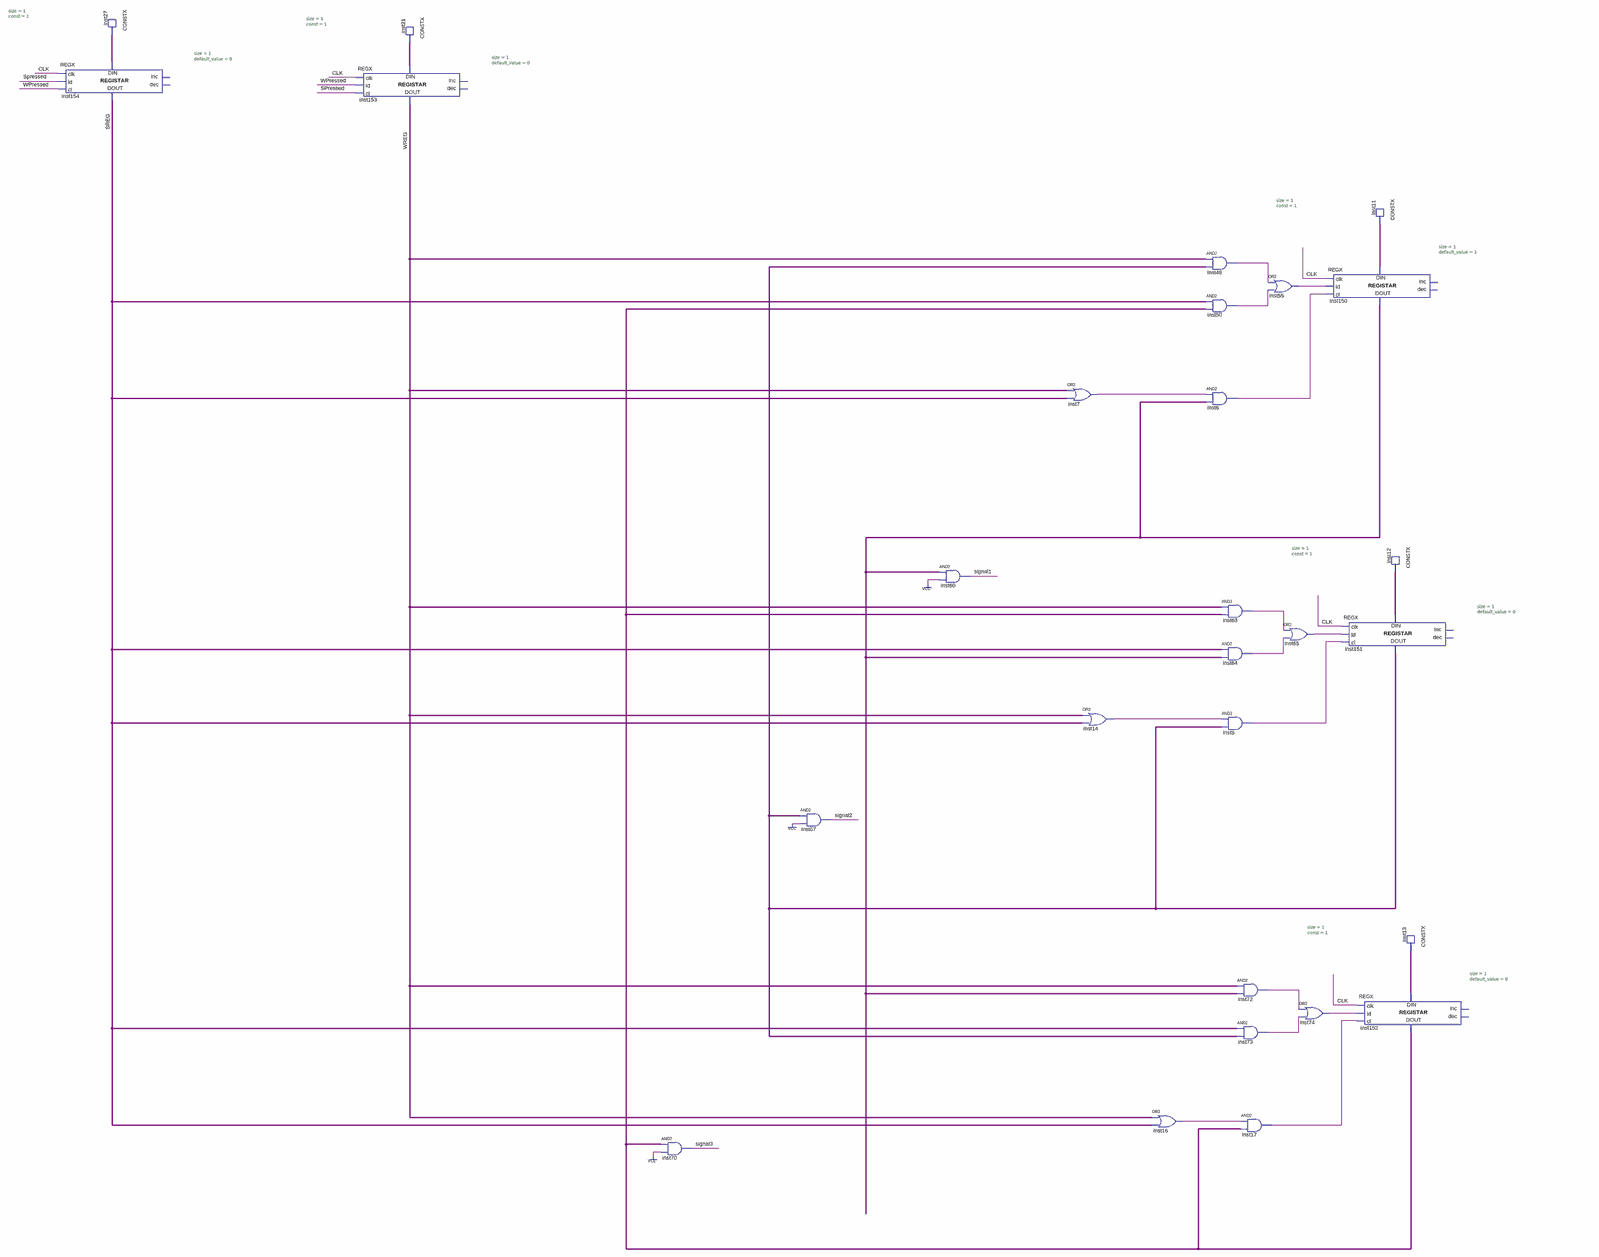
[diagram p0: schematic sheet, whole]
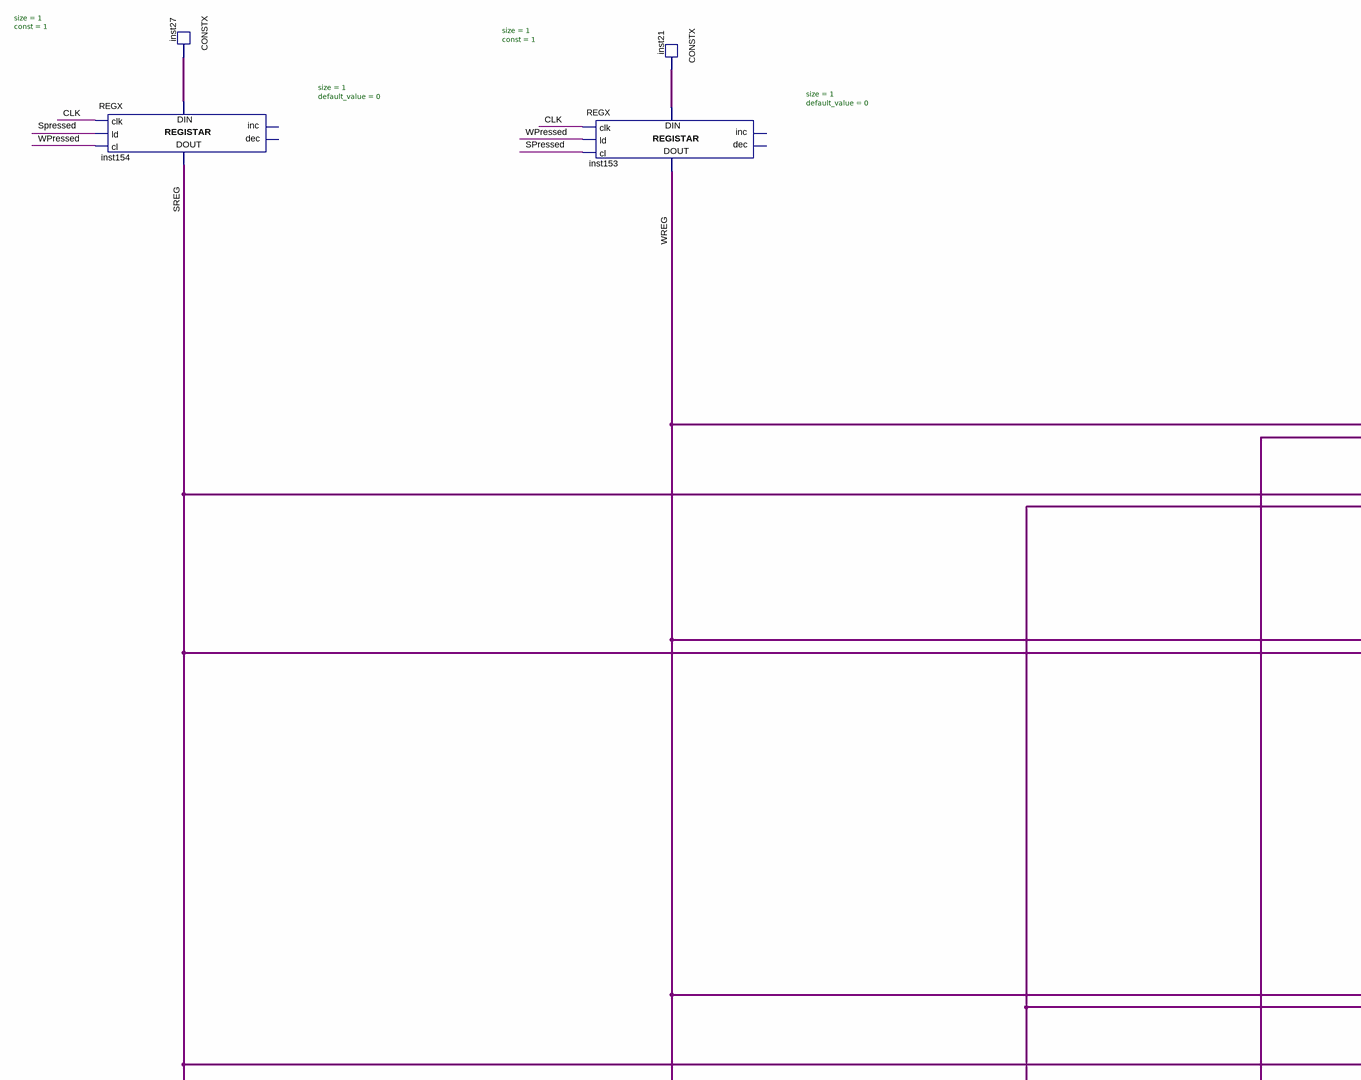
[diagram p1: schematic sheet, upper left part]
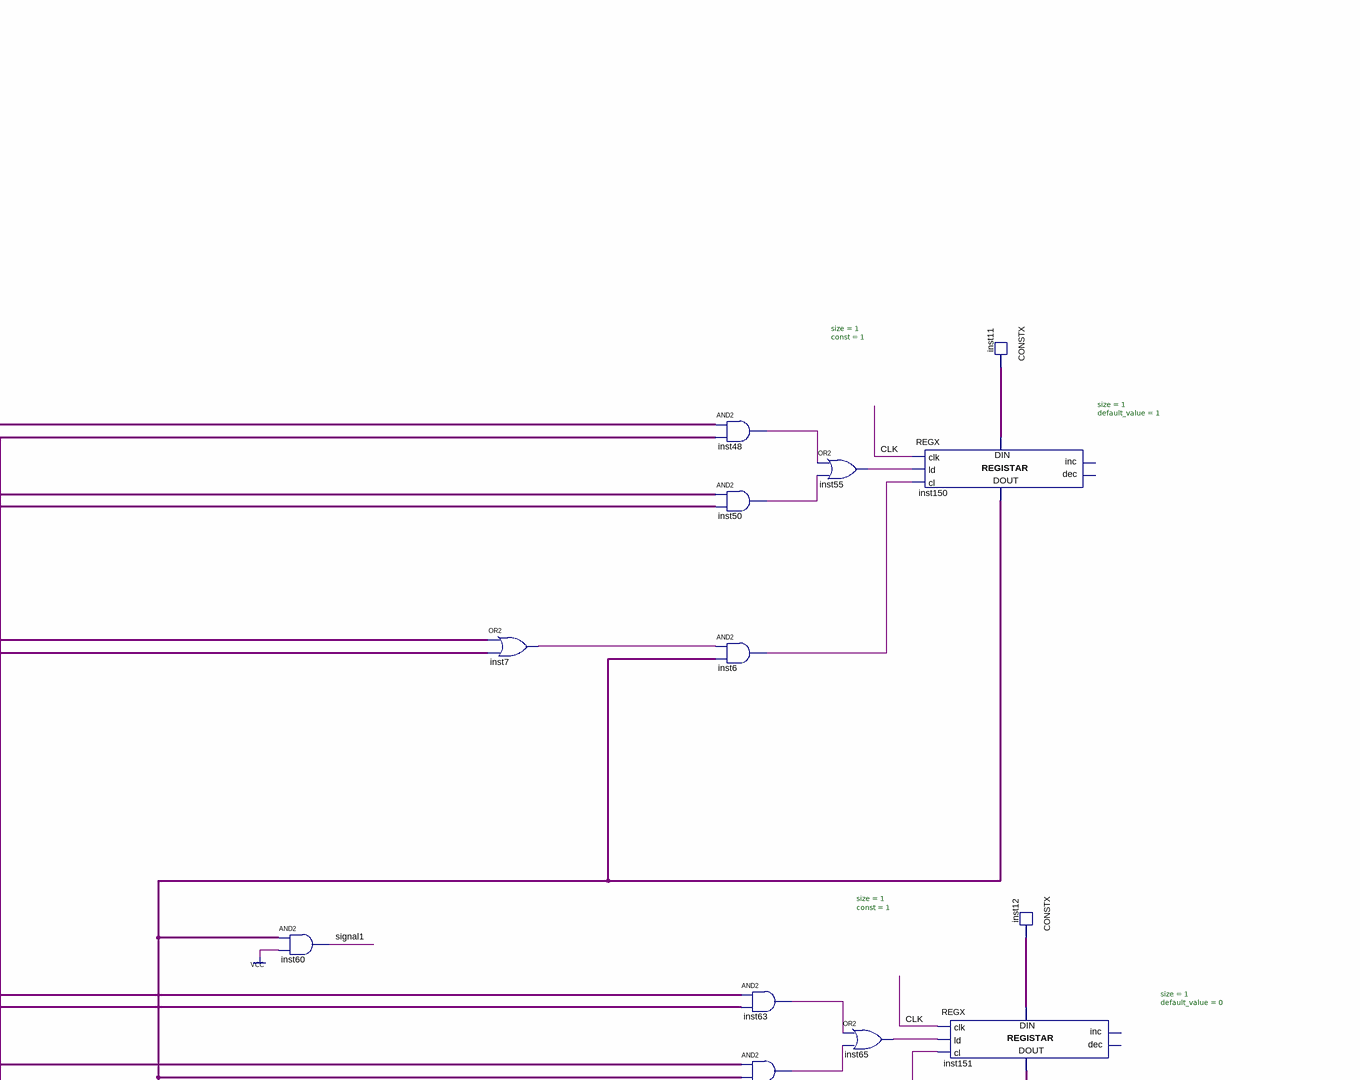
[diagram p2: schematic sheet, upper right part]
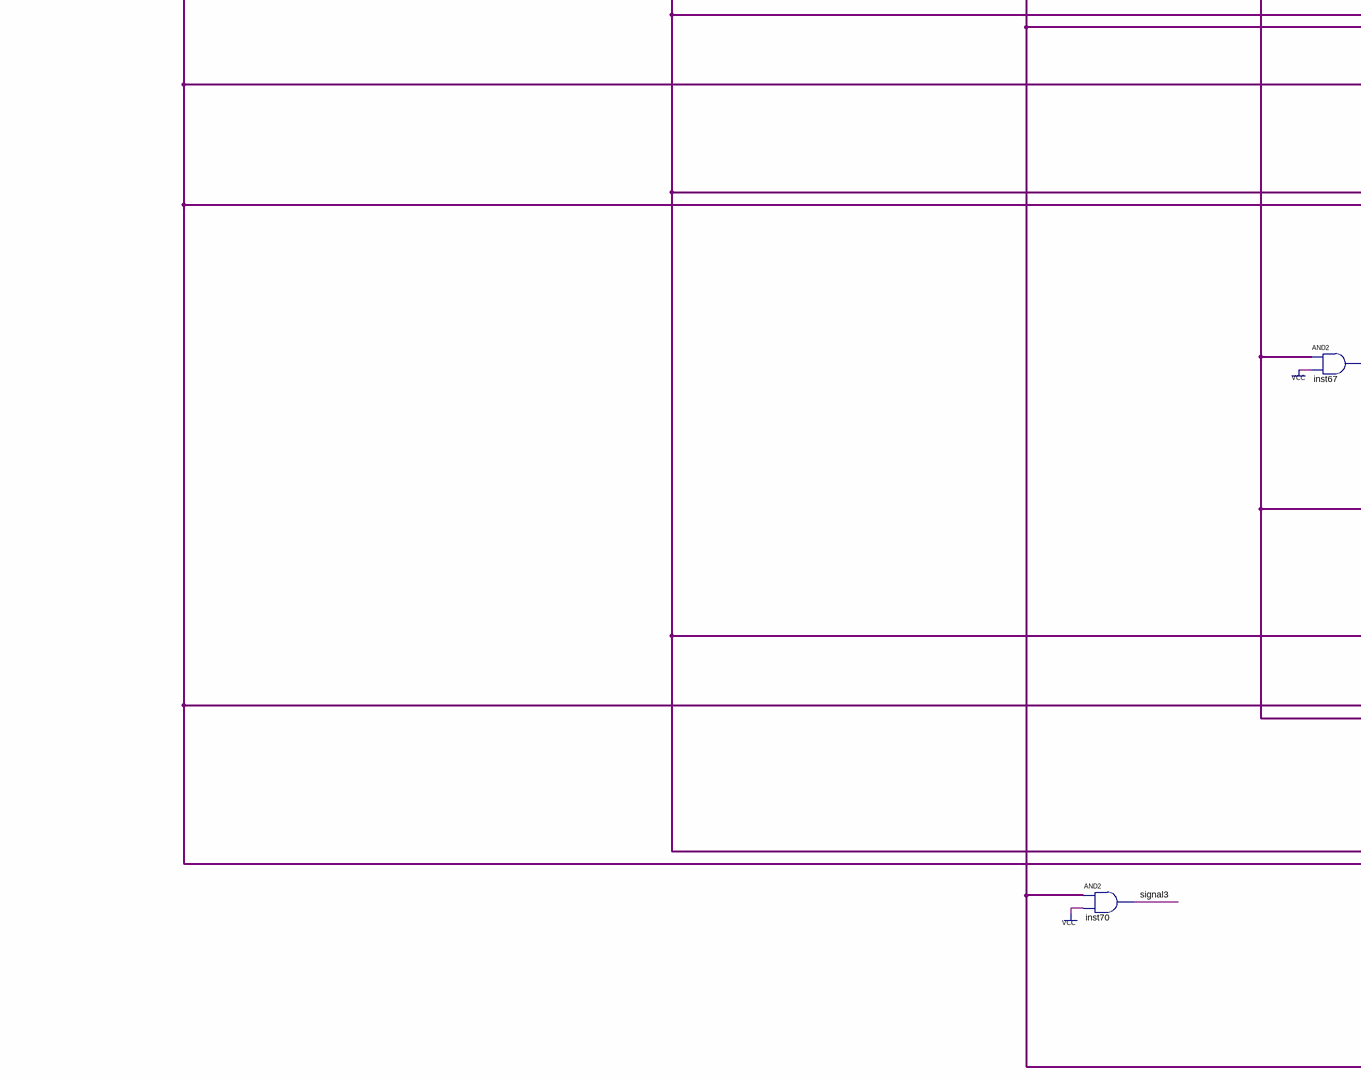
[diagram p3: schematic sheet, lower left part]
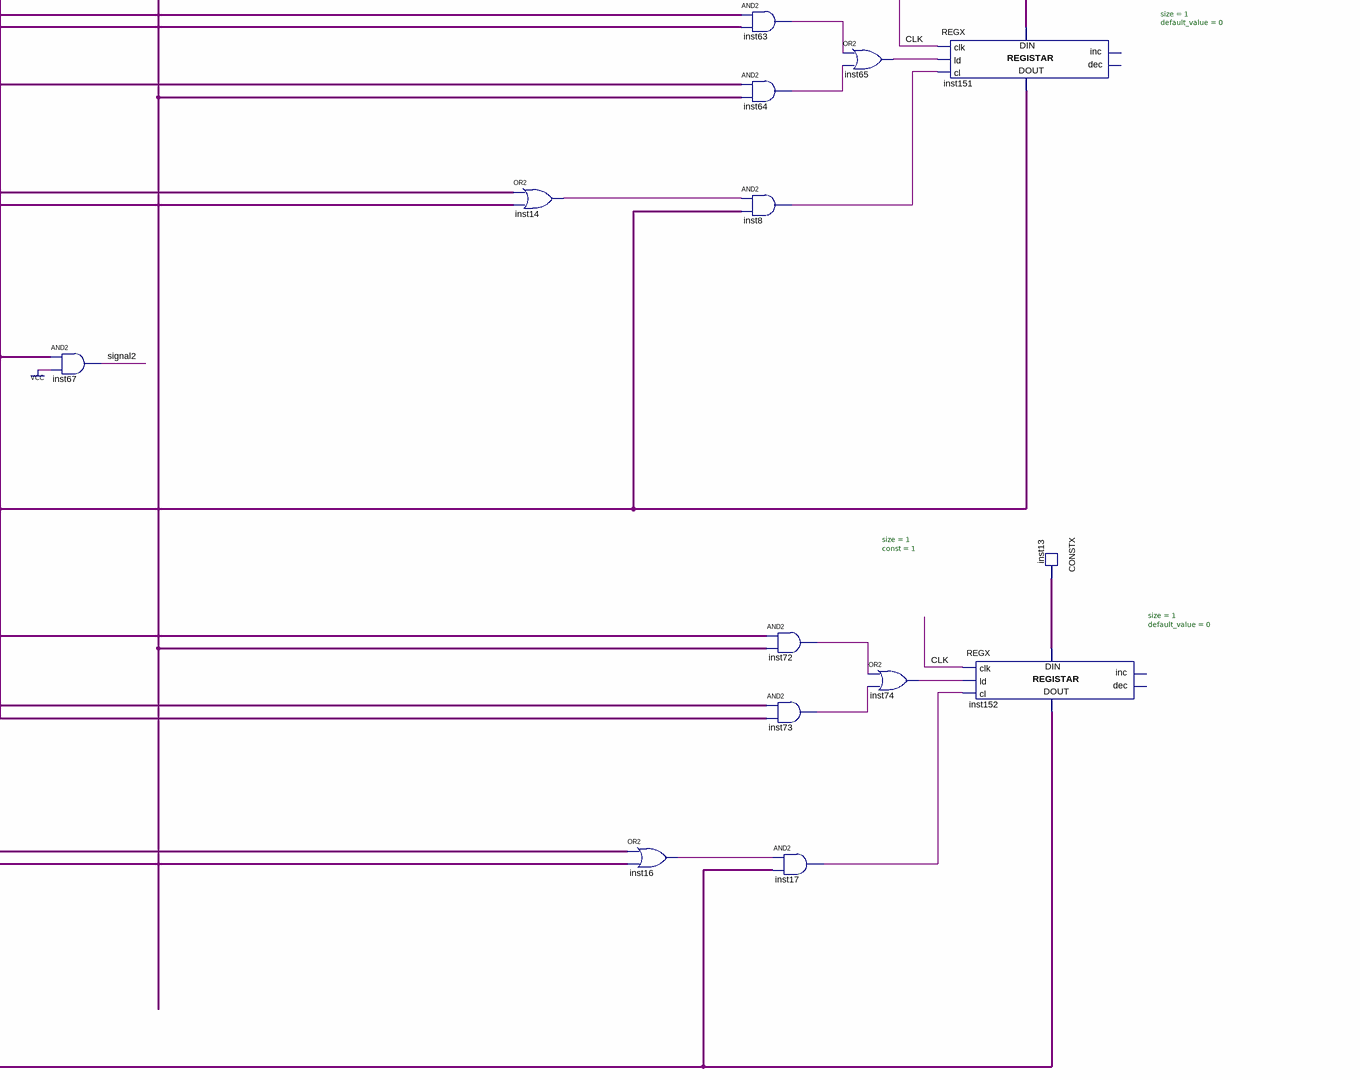
[diagram p4: schematic sheet, lower right part]
// Quartus schematic ImplStrelica2.bdf as structural Verilog: 28 symbols, 0 pins
module ImplStrelica2 (
);

  wire CLK, inst6_out, inst7_out, inst8_out, inst11_data, inst12_data, inst13_data, inst14_out, inst16_out,
       inst17_out, inst21_data, inst27_data, inst48_out, inst50_out, inst55_out, inst63_out, inst64_out,
       inst65_out, inst72_out, inst73_out, inst74_out, inst150_data_out, inst151_data_out, inst152_data_out,
       signal1, signal2, signal3, SPressed, SREG, WPressed, WREG;

  REGX #(.size(1), .default_value(0)) inst154 (
    .clk(CLK), .ld(SPressed), .cl(WPressed), .data_in(inst27_data), .data_out(SREG));  // open: inc, dec
  CONSTX #(.size(1), .\const (1)) inst27 (.data(inst27_data));
  REGX #(.size(1), .default_value(0)) inst153 (
    .clk(CLK), .ld(WPressed), .cl(SPressed), .data_in(inst21_data), .data_out(WREG));  // open: inc, dec
  CONSTX #(.size(1), .\const (1)) inst21 (.data(inst21_data));
  and inst70 (signal3, inst152_data_out, 1'b1);
  and inst67 (signal2, inst151_data_out, 1'b1);
  and inst60 (signal1, inst150_data_out, 1'b1);
  or inst7 (inst7_out, WREG, SREG);
  or inst14 (inst14_out, WREG, SREG);
  or inst16 (inst16_out, WREG, SREG);
  and inst48 (inst48_out, WREG, inst151_data_out);
  and inst50 (inst50_out, SREG, inst152_data_out);
  and inst6 (inst6_out, inst7_out, inst150_data_out);
  and inst63 (inst63_out, WREG, inst152_data_out);
  and inst64 (inst64_out, SREG, inst150_data_out);
  and inst8 (inst8_out, inst14_out, inst151_data_out);
  and inst72 (inst72_out, WREG, inst150_data_out);
  and inst73 (inst73_out, SREG, inst151_data_out);
  and inst17 (inst17_out, inst16_out, inst152_data_out);
  or inst55 (inst55_out, inst48_out, inst50_out);
  or inst65 (inst65_out, inst63_out, inst64_out);
  or inst74 (inst74_out, inst72_out, inst73_out);
  REGX #(.size(1), .default_value(1)) inst150 (
    .clk(CLK), .ld(inst55_out), .cl(inst6_out), .data_in(inst11_data), .data_out(inst150_data_out));  // open: inc, dec
  REGX #(.size(1), .default_value(0)) inst151 (
    .clk(CLK), .ld(inst65_out), .cl(inst8_out), .data_in(inst12_data), .data_out(inst151_data_out));  // open: inc, dec
  CONSTX #(.size(1), .\const (1)) inst11 (.data(inst11_data));
  CONSTX #(.size(1), .\const (1)) inst12 (.data(inst12_data));
  REGX #(.size(1), .default_value(0)) inst152 (
    .clk(CLK), .ld(inst74_out), .cl(inst17_out), .data_in(inst13_data), .data_out(inst152_data_out));  // open: inc, dec
  CONSTX #(.size(1), .\const (1)) inst13 (.data(inst13_data));
endmodule
